# EAGLE schematic INPUT (EAGLE 9.3.2)
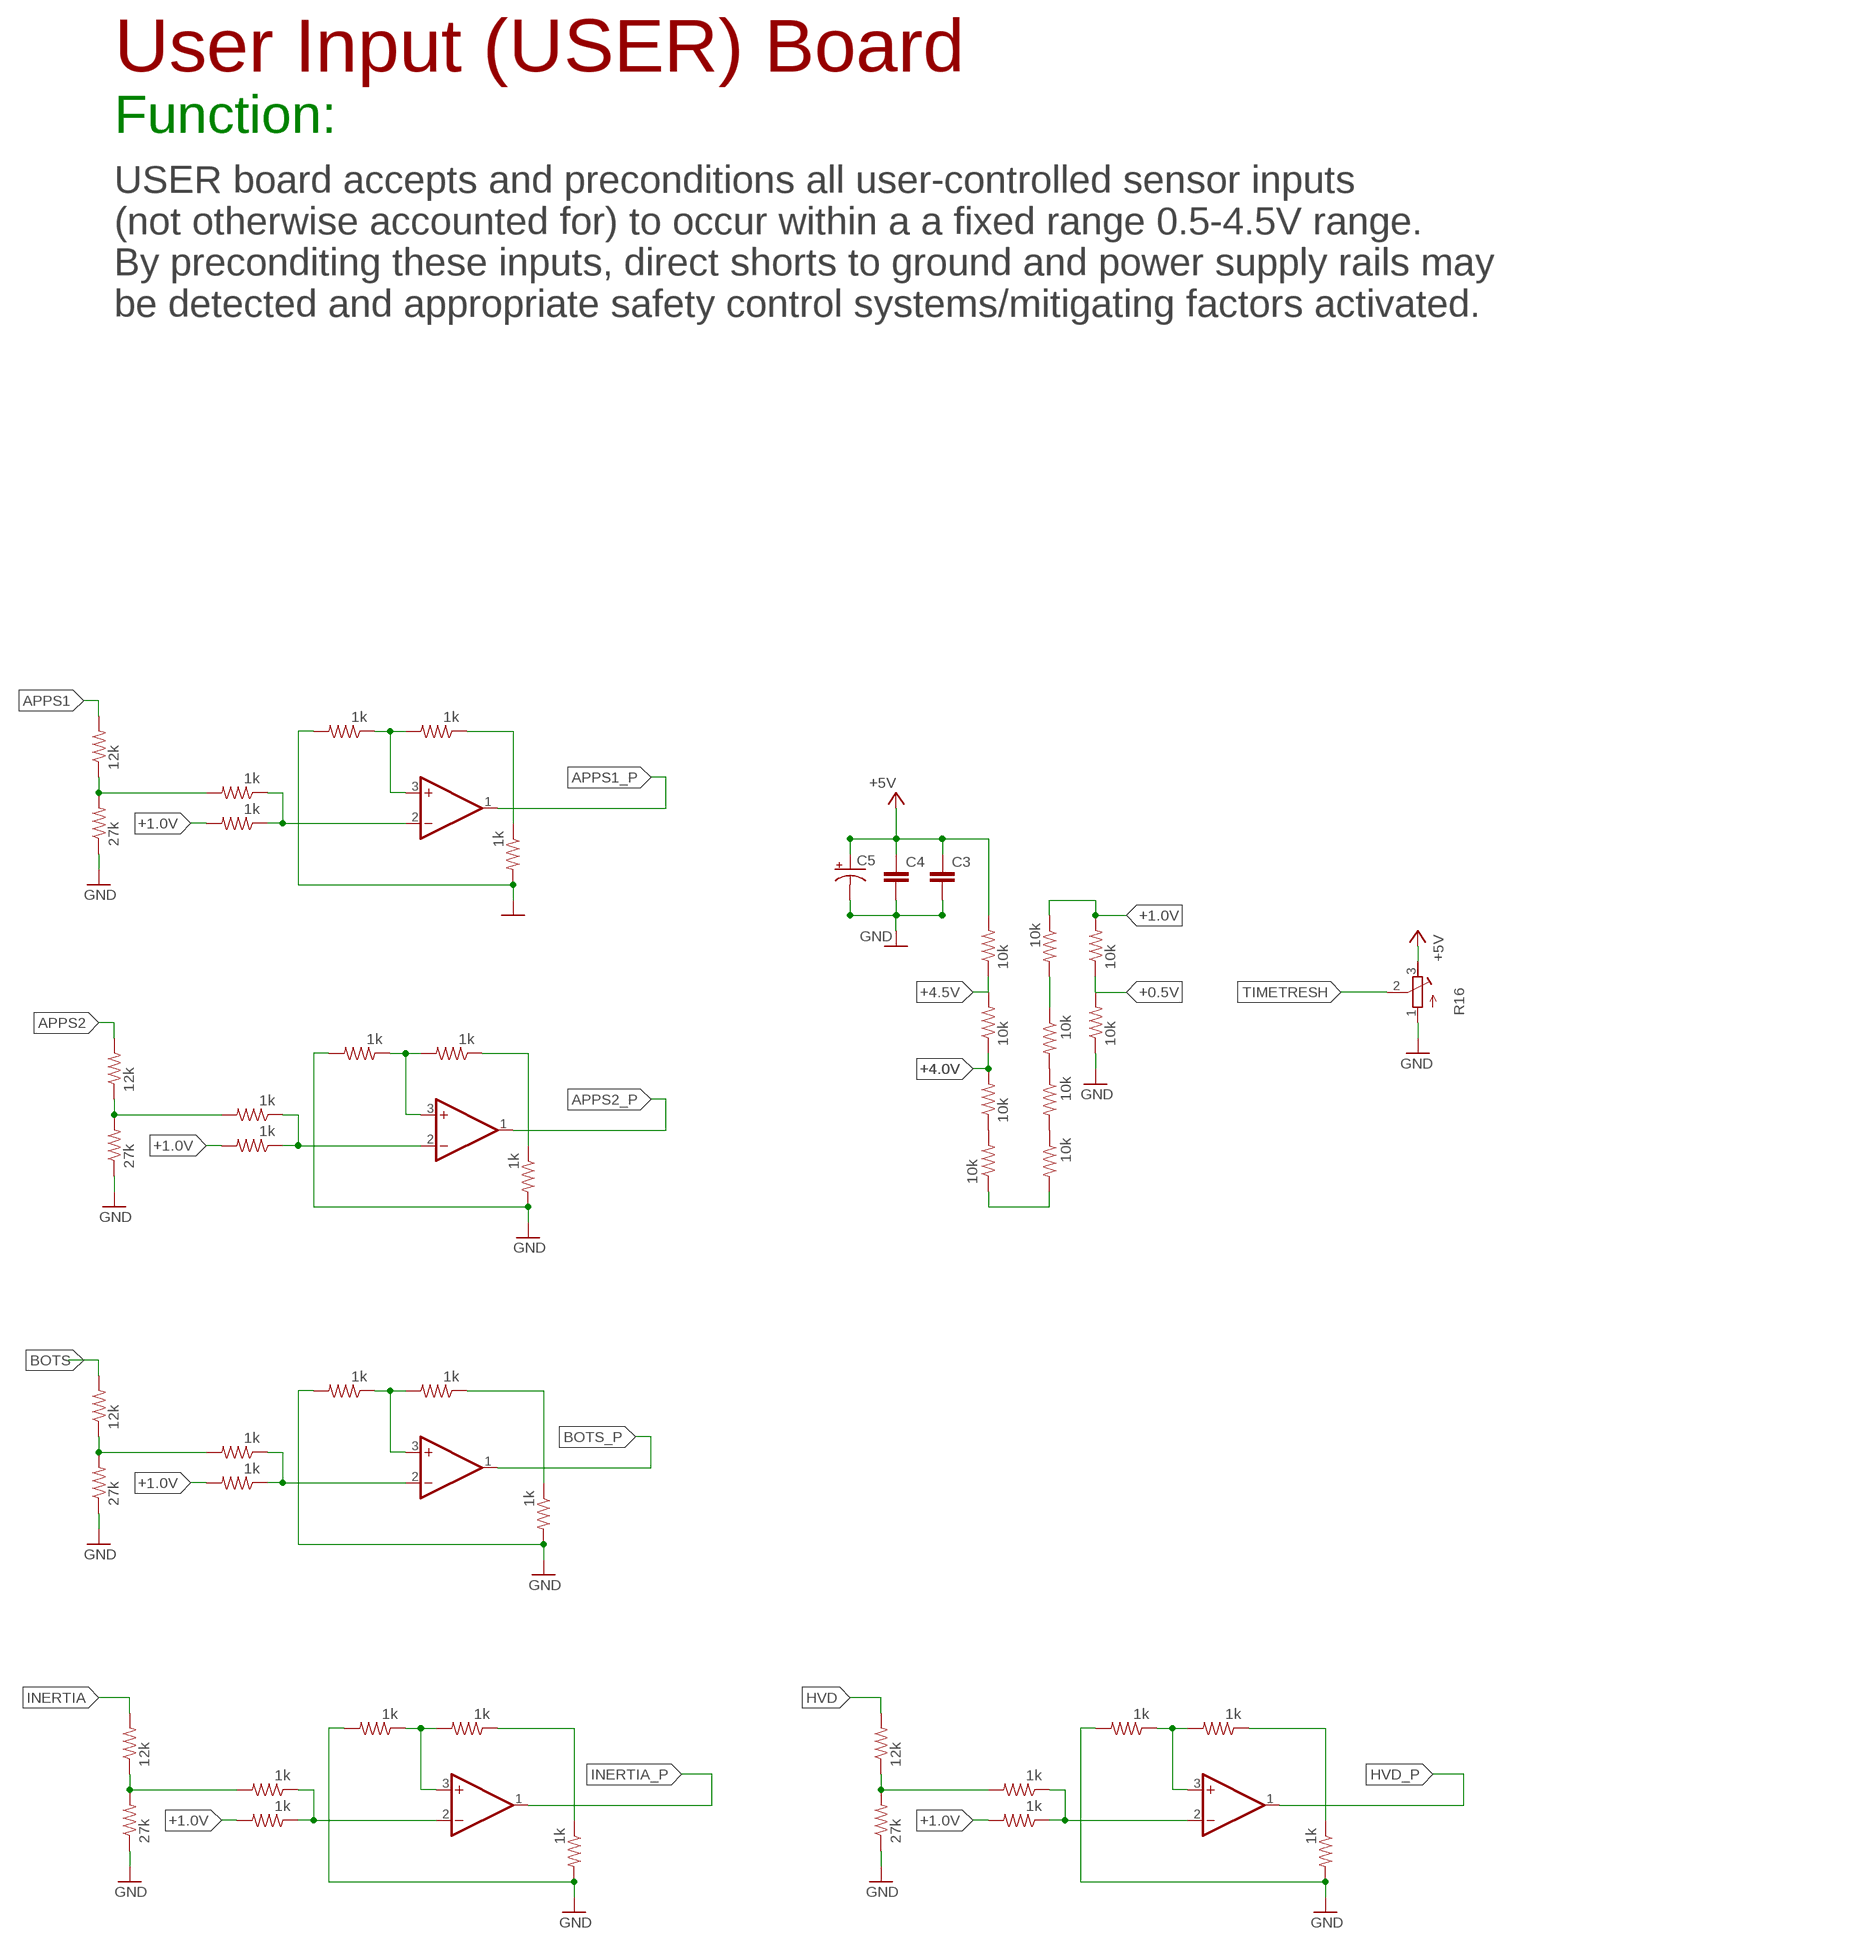
[diagram p0: schematic, sheet 1, part 1 of 2]
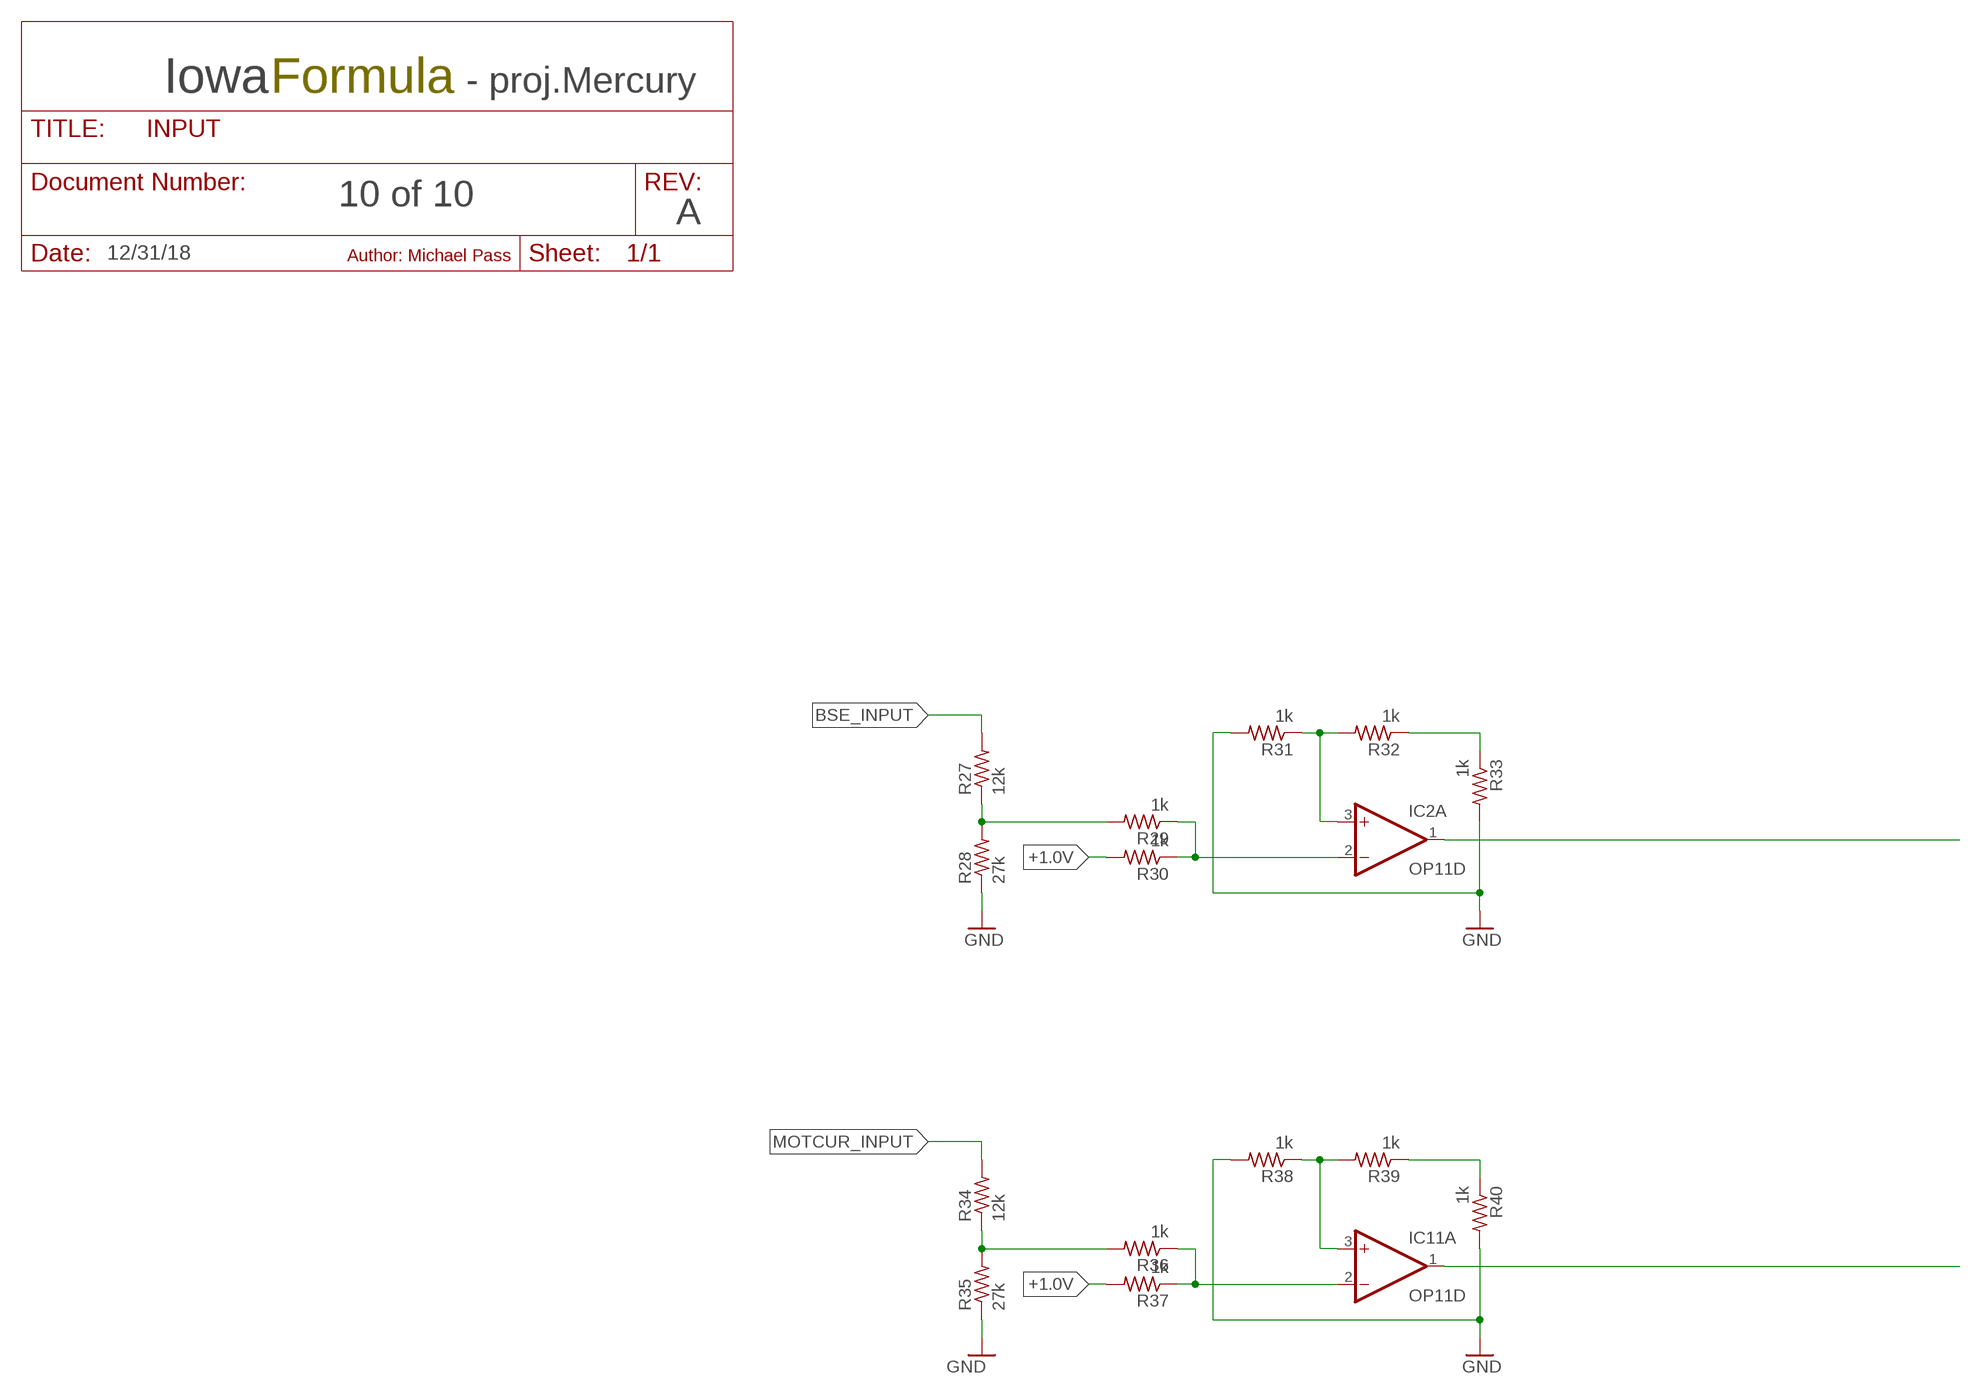
[diagram p1: schematic, sheet 1, part 2 of 2]

## Parts
C3  C-EUC0805  [C0805]
C4  C-EUC0805  [C0805]
C5  CPOL-US085CS-1AR  [085CS_1AR]
IC2  OP11D  [SO14]
IC3  OP11D  [SO14]
IC7  OP11D  [SO14]
IC8  OP11D  [SO14]
IC11  OP11D  [SO14]
IC19  OP11D  [SO14]
IC20  OP11D  [SO14]
R1  12k  R-US_R0805  [R0805]
R2  27k  R-US_R0805  [R0805]
R5  10k  R-US_R0805  [R0805]
R6  10k  R-US_R0805  [R0805]
R7  12k  R-US_R0805  [R0805]
R8  10k  R-US_R0805  [R0805]
R9  10k  R-US_R0805  [R0805]
R10  10k  R-US_R0805  [R0805]
R11  10k  R-US_R0805  [R0805]
R12  10k  R-US_R0805  [R0805]
R13  10k  R-US_R0805  [R0805]
R14  10k  R-US_R0805  [R0805]
R15  10k  R-US_R0805  [R0805]
R16  R-TRIMM3224X  [RTRIM3224X]
R21  27k  R-US_R0805  [R0805]
R22  1k  R-US_R0805  [R0805]
R23  1k  R-US_R0805  [R0805]
R24  1k  R-US_R0805  [R0805]
R25  1k  R-US_R0805  [R0805]
R26  1k  R-US_R0805  [R0805]
R27  12k  R-US_R0805  [R0805]
R28  27k  R-US_R0805  [R0805]
R29  1k  R-US_R0805  [R0805]
R30  1k  R-US_R0805  [R0805]
R31  1k  R-US_R0805  [R0805]
R32  1k  R-US_R0805  [R0805]
R33  1k  R-US_R0805  [R0805]
R34  12k  R-US_R0805  [R0805]
R35  27k  R-US_R0805  [R0805]
R36  1k  R-US_R0805  [R0805]
R37  1k  R-US_R0805  [R0805]
R38  1k  R-US_R0805  [R0805]
R39  1k  R-US_R0805  [R0805]
R40  1k  R-US_R0805  [R0805]
R66  1k  R-US_R0805  [R0805]
R67  1k  R-US_R0805  [R0805]
R68  1k  R-US_R0805  [R0805]
R69  1k  R-US_R0805  [R0805]
R70  1k  R-US_R0805  [R0805]
R71  12k  R-US_R0805  [R0805]
R72  27k  R-US_R0805  [R0805]
R73  1k  R-US_R0805  [R0805]
R74  1k  R-US_R0805  [R0805]
R75  1k  R-US_R0805  [R0805]
R76  1k  R-US_R0805  [R0805]
R77  1k  R-US_R0805  [R0805]
R78  12k  R-US_R0805  [R0805]
R79  27k  R-US_R0805  [R0805]
R80  1k  R-US_R0805  [R0805]
R81  1k  R-US_R0805  [R0805]
R82  1k  R-US_R0805  [R0805]
R83  1k  R-US_R0805  [R0805]
R84  1k  R-US_R0805  [R0805]
R85  12k  R-US_R0805  [R0805]
R86  27k  R-US_R0805  [R0805]
R87  1k  R-US_R0805  [R0805]
R88  1k  R-US_R0805  [R0805]
R89  1k  R-US_R0805  [R0805]
R90  1k  R-US_R0805  [R0805]
R91  1k  R-US_R0805  [R0805]

## Nets
+0.5V: R14.1 R15.2
+1.0V: R13.1 R14.2 R23.2 R30.2 R37.2 R67.2 R74.2 R81.2 R88.2
+4.0V: R6.1 R8.2
+4.5V: R5.1 R6.2
+5V: C3.1 C4.1 C5.+ R5.2 R16.3(E)
APPS1: R71.2
APPS1_P: IC7.1(A:OUT)
APPS2: R78.2
APPS2_P: IC19.1(A:OUT)
BOTS: R7.2
BOTS_P: IC8.1(A:OUT)
BSE_INPUT: R27.2
BSE_PROCESSED: IC2.1(A:OUT)
GND: C3.2 C4.2 C5.- R2.1 R15.1 R16.1(A) R21.1 R24.2 R26.2 R28.1 R31.2 R33.2 R35.1 R38.2 R40.2 R68.2 R70.2 R72.1 R75.2 R77.2 R79.1 R82.2 R84.2 R86.1 R89.2 R91.2
HVD: R85.2
HVD_P: IC20.1(A:OUT)
INERTIA: R1.2
INERTIA_P: IC3.1(A:OUT)
MOTCUR_INPUT: R34.2
MOTCUR_PROCESSED: IC11.1(A:OUT)
N$1: IC3.3(A:+IN) R68.1 R69.2
N$2: R8.1 R9.2
N$4: R9.1 R10.2
N$5: R11.1 R12.2
N$7: R12.1 R13.2
N$8: R1.1 R2.2 R66.2
N$9: R10.1 R11.2
N$10: R69.1 R70.1
N$11: IC3.2(A:-IN) R66.1 R67.1
N$19: IC2.3(A:+IN) R31.1 R32.2
N$21: R27.1 R28.2 R29.2
N$22: R32.1 R33.1
N$25: IC2.2(A:-IN) R29.1 R30.1
N$28: IC8.3(A:+IN) R24.1 R25.2
N$29: R7.1 R21.2 R22.2
N$30: R25.1 R26.1
N$31: IC8.2(A:-IN) R22.1 R23.1
N$32: IC11.3(A:+IN) R38.1 R39.2
N$33: R34.1 R35.2 R36.2
N$36: R39.1 R40.1
N$37: IC11.2(A:-IN) R36.1 R37.1
N$44: IC7.3(A:+IN) R75.1 R76.2
N$45: R71.1 R72.2 R73.2
N$66: R76.1 R77.1
N$67: IC7.2(A:-IN) R73.1 R74.1
N$68: IC19.3(A:+IN) R82.1 R83.2
N$69: R78.1 R79.2 R80.2
N$70: R83.1 R84.1
N$71: IC19.2(A:-IN) R80.1 R81.1
N$72: IC20.3(A:+IN) R89.1 R90.2
N$73: R85.1 R86.2 R87.2
N$74: R90.1 R91.1
N$75: IC20.2(A:-IN) R87.1 R88.1
TIMETRESH: R16.2(S)
Unconnected: IC2.5(B:+IN) IC2.6(B:-IN) IC2.7(B:OUT) IC2.8(C:OUT) IC2.9(C:-IN) IC2.10(C:+IN) IC2.12(D:+IN) IC2.13(D:-IN) IC2.14(D:OUT) IC3.5(B:+IN) IC3.6(B:-IN) IC3.7(B:OUT) IC3.8(C:OUT) IC3.9(C:-IN) IC3.10(C:+IN) IC3.12(D:+IN) IC3.13(D:-IN) IC3.14(D:OUT) IC7.5(B:+IN) IC7.6(B:-IN) IC7.7(B:OUT) IC7.8(C:OUT) IC7.9(C:-IN) IC7.10(C:+IN) IC7.12(D:+IN) IC7.13(D:-IN) IC7.14(D:OUT) IC8.5(B:+IN) IC8.6(B:-IN) IC8.7(B:OUT) IC8.8(C:OUT) IC8.9(C:-IN) IC8.10(C:+IN) IC8.12(D:+IN) IC8.13(D:-IN) IC8.14(D:OUT) IC11.5(B:+IN) IC11.6(B:-IN) IC11.7(B:OUT) IC11.8(C:OUT) IC11.9(C:-IN) IC11.10(C:+IN) IC11.12(D:+IN) IC11.13(D:-IN) IC11.14(D:OUT) IC19.5(B:+IN) IC19.6(B:-IN) IC19.7(B:OUT) IC19.8(C:OUT) IC19.9(C:-IN) IC19.10(C:+IN) IC19.12(D:+IN) IC19.13(D:-IN) IC19.14(D:OUT) IC20.5(B:+IN) IC20.6(B:-IN) IC20.7(B:OUT) IC20.8(C:OUT) IC20.9(C:-IN) IC20.10(C:+IN) IC20.12(D:+IN) IC20.13(D:-IN) IC20.14(D:OUT)

## Notes on the sheet
- User Input (USER) Board
- Function:
- Iowa | Formula | - proj.Mercury
- 10 of 10
- USER board accepts and preconditions all user-controlled sensor inputs
  (not otherwise accounted for) to occur within a a fixed range 0.5-4.5V range.
  By preconditing these inputs, direct shorts to ground and power supply rails may
  be detected and appropriate safety control systems/mitigating factors activated.
- A
- 12/31/18 | Author: Michael Pass

## Power pins joined to a net without a drawn wire
V+: IC2.4(P:V+) IC3.4(P:V+) IC7.4(P:V+) IC8.4(P:V+) IC11.4(P:V+) IC19.4(P:V+) IC20.4(P:V+)
V-: IC2.11(P:V-) IC3.11(P:V-) IC7.11(P:V-) IC8.11(P:V-) IC11.11(P:V-) IC19.11(P:V-) IC20.11(P:V-)

## Library data of the parts
C3 C4 = rcl:C-EU: CAPACITOR, European symbol; SPICEPREFIX: C
C5 = rcl:CPOL-US: POLARIZED CAPACITOR, American symbol; SPICEPREFIX: C
IC2 IC3 IC7 IC8 IC11 IC19 IC20 = linear:OP11: Quad Low-Offset Low-Power OP AMP The OP-11 is pin compatible with the OP-400 , LM148, HA4741, RM4156, and LT1014 operational amplifiers source http://products.analog.com/products/info.asp?product=OP400
R1 R2 R5-R15 R21-R40 R66-R91 = rcl:R-US_: RESISTOR, American symbol; SPICEPREFIX: R
R16 = rcl:R-TRIMM: Trimm resistor; SPICEMODEL: X; SPICEPREFIXL: POT